# Altium schematic sheet CH340E.SchDoc
size A4
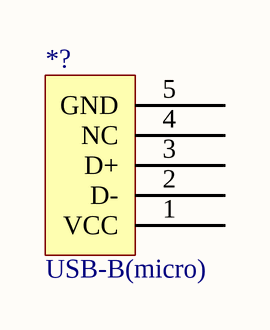
[diagram p0: CH340E.SchDoc]

## Parts
*?  USB-B(micro)  [MICRO-USB]

## Nets

Not connected (* = marked no-connect by the designer): *? 1(VCC) 2(D-) 3(D+) 4(NC) 5(GND)